# EAGLE schematic ProcessorTestBoardV1_0 (EAGLE 7.3.0)
Small breakout board to test basic funtionality of processor. Contains programming connectors, I2C IR sensors, 3V3 and 3V6 voltage regulators, a bus switch, and the MRAM.
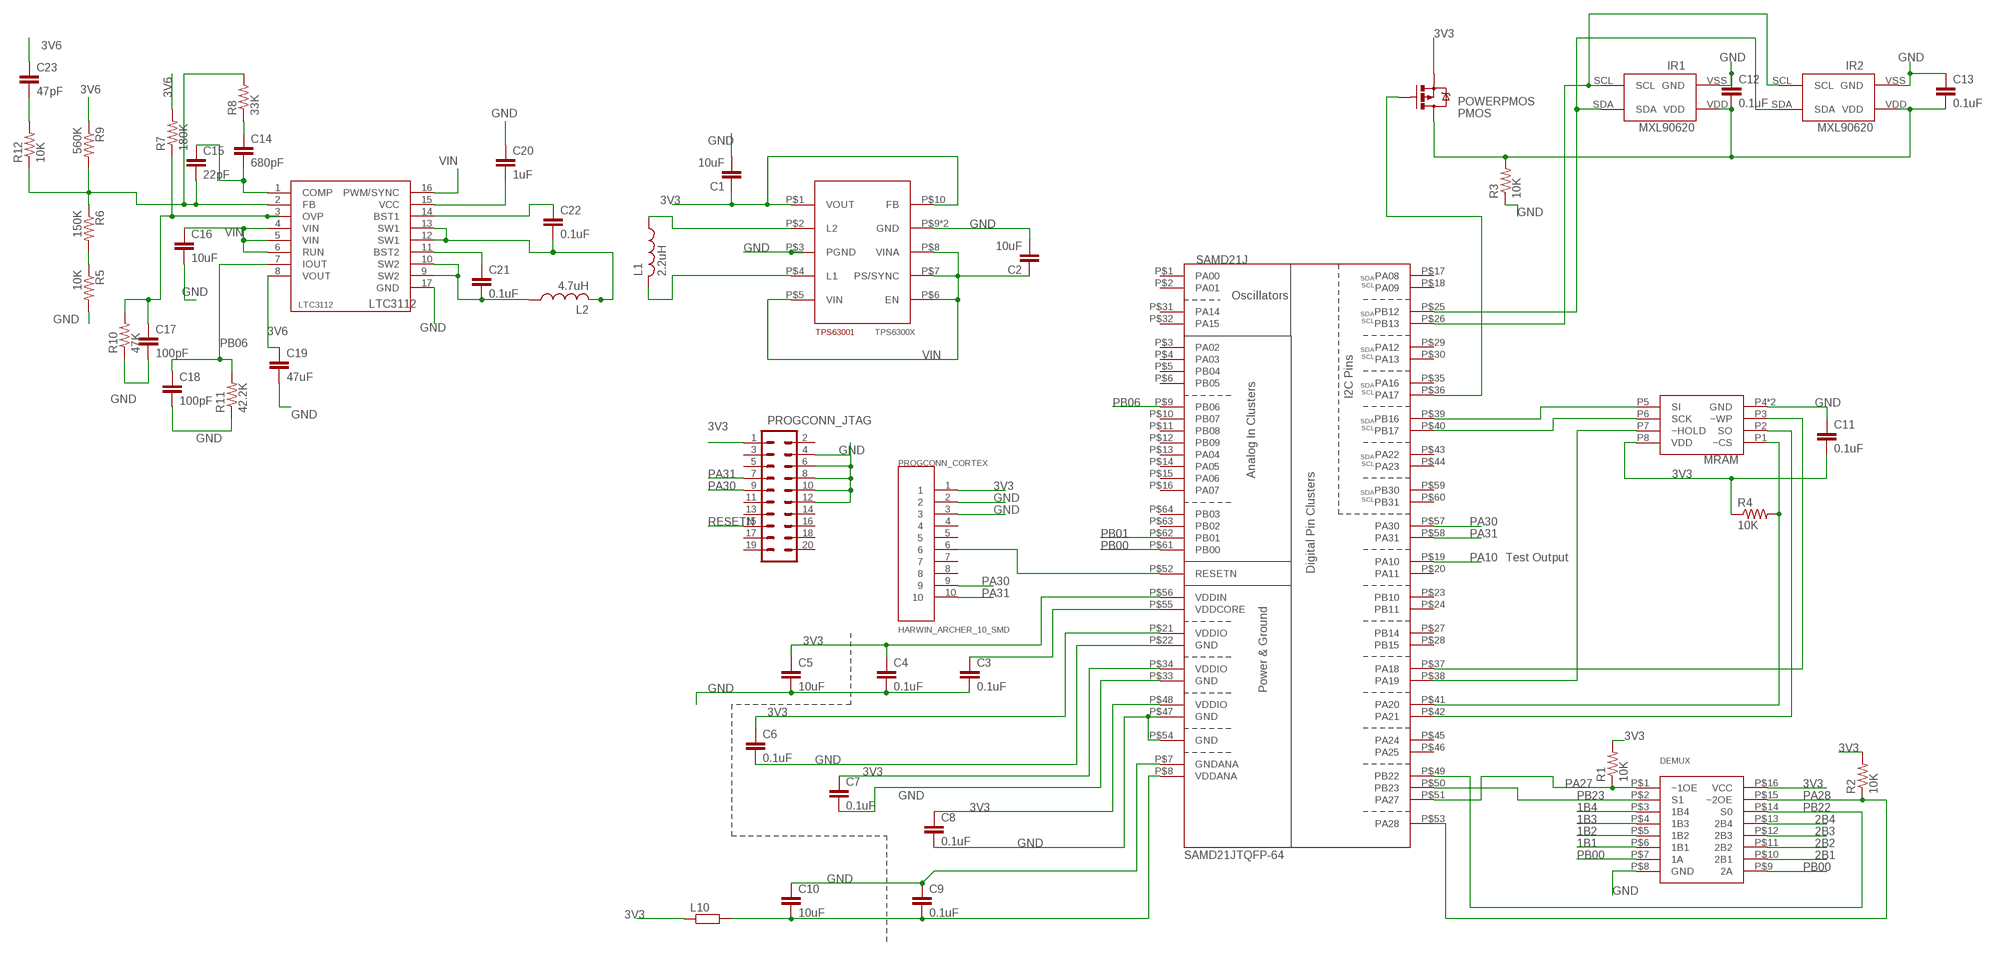
[diagram p0: schematic, sheet 1]

## Parts
C1  10uF  CAP0805  [0805]
C2  10uF  CAP0805  [0805]
C3  0.1uF  CAP0805  [0805]
C4  0.1uF  CAP0805  [0805]
C5  10uF  CAP0805  [0805]
C6  0.1uF  CAP0805  [0805]
C7  0.1uF  CAP0805  [0805]
C8  0.1uF  CAP0805  [0805]
C9  0.1uF  CAP0805  [0805]
C10  10uF  CAP0805  [0805]
C11  0.1uF  CAP0805  [0805]
C12  0.1uF  CAP0805  [0805]
C13  0.1uF  CAP0805  [0805]
C14  680pF  CAP0805  [0805]
C15  22pF  CAP0805  [0805]
C16  10uF  CAP0805  [0805]
C17  100pF  CAP0805  [0805]
C18  100pF  CAP0805  [0805]
C19  47uF  CAP0805  [0805]
C20  1uF  CAP0805  [0805]
C21  0.1uF  CAP0805  [0805]
C22  0.1uF  CAP0805  [0805]
C23  47pF  CAP0805  [0805]
DEMUX  SN74CBTLV3253  [SOIC16R]
IR1  MXL90620  [MXL90620]
IR2  MXL90620  [MXL90620]
L1  2.2uH  L-USL3225M  [L3225M]
L2  4.7uH  L-USL3225M  [L3225M]
L10  R-EU_R0805  [R0805]
LTC3112  LTC3112  [DHD16]
MRAM  MR25H10CDC  [8PXMO-229]
PMOS  POWERPMOS  [SO08]
PROGCONN_CORTEX  HARWIN_ARCHER_10_SMD  [HARWIN_ARCHER_10_SMD]
PROGCONN_JTAG  IDC_JTAG_CONNECTOR  [2X10]
R1  10K  RESISTOR  [0805]
R2  10K  RESISTOR  [0805]
R3  10K  RESISTOR  [0805]
R4  10K  RESISTOR  [0805]
R5  10K  RESISTOR  [0805]
R6  150K  RESISTOR  [0805]
R7  180K  RESISTOR  [0805]
R8  33K  RESISTOR  [0805]
R9  560K  RESISTOR  [0805]
R10  47K  RESISTOR  [0805]
R11  42.2K  RESISTOR  [0805]
R12  10K  RESISTOR  [0805]
SAMD21J  SAMD21JTQFP-64  [TQFP-64]
TPS63001  TPS6300X  [QFN10_POWERPAD]

## Nets
1B1: DEMUX.P$6(1B1)
1B2: DEMUX.P$5(1B2)
1B3: DEMUX.P$4(1B3)
1B4: DEMUX.P$3(1B4)
2B1: DEMUX.P$10(2B1)
2B2: DEMUX.P$11(2B2)
2B3: DEMUX.P$12(2B3)
2B4: DEMUX.P$13(2B4)
3V3: C1.1 C4.1 C5.1 C6.1 C7.1 C8.1 C11.2 DEMUX.P$16(VCC) L10.1 MRAM.P8(VDD) PMOS.1(S) PMOS.2(S) PMOS.3(S) PROGCONN_CORTEX.1 PROGCONN_JTAG.1 R1.2 R2.2 R4.1 SAMD21J.P$21(VDDIO) SAMD21J.P$34(VDDIO) SAMD21J.P$48(VDDIO) SAMD21J.P$56(VDDIN) TPS63001.P$1(VOUT) TPS63001.P$10(FB)
3V6: C19.1 C23.1 LTC3112.8(VOUT) R7.2 R9.1
COMP: C14.2 C15.1 LTC3112.1(COMP)
FB: C15.2 LTC3112.2(FB) R6.1 R8.2 R9.2 R12.1
GND: C1.2 C2.2 C3.2 C4.2 C5.2 C6.2 C7.2 C8.2 C9.1 C10.1 C11.1 C12.1 C13.1 C16.2 C17.2 C18.2 C19.2 C20.1 DEMUX.P$8(GND) IR1.VSS(GND) IR2.VSS(GND) LTC3112.17(GND) MRAM.P4(GND) MRAM.P9(GND) PROGCONN_CORTEX.2 PROGCONN_CORTEX.3 PROGCONN_JTAG.4 PROGCONN_JTAG.6 PROGCONN_JTAG.8 PROGCONN_JTAG.10 PROGCONN_JTAG.12 R3.1 R5.2 R10.1 R11.1 SAMD21J.P$7(GNDANA) SAMD21J.P$22(GND) SAMD21J.P$33(GND) SAMD21J.P$47(GND) SAMD21J.P$54(GND) TPS63001.P$3(PGND) TPS63001.P$9(GND) TPS63001.PAD(GND)
N$1: C12.2 C13.2 IR1.VDD IR2.VDD PMOS.5(D) PMOS.6(D) PMOS.7(D) PMOS.8(D) R3.2
N$2: L1.2 TPS63001.P$4(L1)
N$3: L1.1 TPS63001.P$2(L2)
N$4: C14.1 R8.1
N$5: C23.2 R12.2
N$6: R5.1 R6.2
N$8: C3.1 SAMD21J.P$55(VDDCORE)
N$17: C9.2 C10.2 L10.2 SAMD21J.P$8(VDDANA)
N$23: C20.2 LTC3112.15(VCC)
N$25: C22.1 LTC3112.14(BST1)
N$26: C22.2 L2.2 LTC3112.12(SW1) LTC3112.13(SW1)
N$28: C21.2 L2.1 LTC3112.9(SW2) LTC3112.10(SW2)
N$29: C21.1 LTC3112.11(BST2)
OVP: C17.1 LTC3112.3(OVP) R7.1 R10.2
PA10: SAMD21J.P$19(PA10)
PA17: PMOS.4(G) SAMD21J.P$36(PA17)
PA27: DEMUX.P$1(~1OE) R1.1 SAMD21J.P$51(PA27)
PA28: DEMUX.P$15(~2OE) R2.1 SAMD21J.P$53(PA28)
PA30: PROGCONN_CORTEX.9 PROGCONN_JTAG.9 SAMD21J.P$57(PA30)
PA31: PROGCONN_CORTEX.10 PROGCONN_JTAG.7 SAMD21J.P$58(PA31)
PB00: DEMUX.P$7(1A) DEMUX.P$9(2A) SAMD21J.P$61(PB00)
PB01: SAMD21J.P$62(PB01)
PB06: C18.1 LTC3112.7(IOUT) R11.2 SAMD21J.P$9(PB06)
PB22: DEMUX.P$14(S0) SAMD21J.P$49(PB22)
PB23: DEMUX.P$2(S1) SAMD21J.P$50(PB23)
RESETN: PROGCONN_CORTEX.6 PROGCONN_JTAG.15 SAMD21J.P$52(RESETN)
SCK: MRAM.P6(SCK) SAMD21J.P$40(PB17)
SCL: IR1.SCL IR2.SCL SAMD21J.P$26(PB13)
SDA: IR1.SDA IR2.SDA SAMD21J.P$25(PB12)
SI: MRAM.P5(SI) SAMD21J.P$39(PB16)
SO: MRAM.P2(SO) SAMD21J.P$42(PA21)
VIN: C2.1 C16.1 LTC3112.4(VIN) LTC3112.5(VIN) LTC3112.6(RUN) LTC3112.16(PWM/SYNC) TPS63001.P$5(VIN) TPS63001.P$6(EN) TPS63001.P$7(PS/SYNC) TPS63001.P$8(VINA)
~CS: MRAM.P1(~CS) R4.2 SAMD21J.P$41(PA20)
~HOLD: MRAM.P7(~HOLD) SAMD21J.P$38(PA19)
~WP: MRAM.P3(~WP) SAMD21J.P$37(PA18)
Unconnected: PROGCONN_CORTEX.4 PROGCONN_CORTEX.5 PROGCONN_CORTEX.7 PROGCONN_CORTEX.8 PROGCONN_JTAG.2 PROGCONN_JTAG.3 PROGCONN_JTAG.5 PROGCONN_JTAG.11 PROGCONN_JTAG.13 PROGCONN_JTAG.14 PROGCONN_JTAG.16 PROGCONN_JTAG.17 PROGCONN_JTAG.18 PROGCONN_JTAG.19 PROGCONN_JTAG.20 SAMD21J.P$1(PA00) SAMD21J.P$2(PA01) SAMD21J.P$3(PA02) SAMD21J.P$4(PA03) SAMD21J.P$5(PB04) SAMD21J.P$6(PB05) SAMD21J.P$10(PB07) SAMD21J.P$11(PB08) SAMD21J.P$12(PB09) SAMD21J.P$13(PA04) SAMD21J.P$14(PA05) SAMD21J.P$15(PA06) SAMD21J.P$16(PA07) SAMD21J.P$17(PA08) SAMD21J.P$18(PA09) SAMD21J.P$20(PA11) SAMD21J.P$23(PB10) SAMD21J.P$24(PB11) SAMD21J.P$27(PB14) SAMD21J.P$28(PB15) SAMD21J.P$29(PA12) SAMD21J.P$30(PA13) SAMD21J.P$31(PA14) SAMD21J.P$32(PA15) SAMD21J.P$35(PA16) SAMD21J.P$43(PA22) SAMD21J.P$44(PA23) SAMD21J.P$45(PA24) SAMD21J.P$46(PA25) SAMD21J.P$59(PB30) SAMD21J.P$60(PB31) SAMD21J.P$63(PB02) SAMD21J.P$64(PB03)

## Notes on the sheet
- Test Output

## Library data of the parts
C1-C23 = CNTRL_BOARD:CAP: Capacitor Standard 0603 ceramic capacitor, and 0.1" leaded capacitor.
DEMUX = CNTRL_BOARD:SN74CBTLV3253
IR1 IR2 = CNTRL_BOARD:MXL90620
L1 L2 = resistor:L-US: INDUCTOR, American symbol
L10 = rcl:R-EU_: RESISTOR, European symbol
LTC3112 = CNTRL_BOARD:LTC3112
MRAM = mram:MR25H10CDC
PMOS = CNTRL_BOARD:POWERPMOS
PROGCONN_CORTEX = CNTRL_BOARD:HARWIN_ARCHER_10_SMD
PROGCONN_JTAG = CNTRL_BOARD:IDC_JTAG_CONNECTOR
R1-R12 = CNTRL_BOARD:RESISTOR
SAMD21J = SAMD21J_Easy:SAMD21J
TPS63001 = CNTRL_BOARD:TPS6300X